# EAGLE design LRF Breakout (EAGLE 8.6.0)
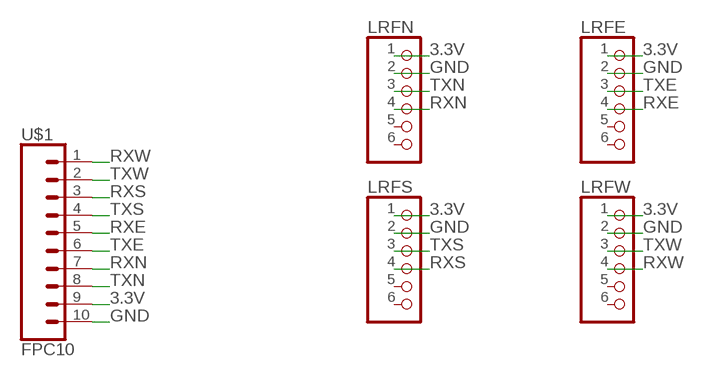
[diagram p0: schematic, sheet 1]

## Parts
LRFE  PINHD-1X6  [1X06]
LRFN  PINHD-1X6  [1X06]
LRFS  PINHD-1X6  [1X06]
LRFW  PINHD-1X6  [1X06]
U$1  FPC10  [FPC10]

## Nets
3.3V: LRFE.1 LRFN.1 LRFS.1 LRFW.1 U$1.9
GND: LRFE.2 LRFN.2 LRFS.2 LRFW.2 U$1.10
RXE: LRFE.4 U$1.5
RXN: LRFN.4 U$1.7
RXS: LRFS.4 U$1.3
RXW: LRFW.4 U$1.1
TXE: LRFE.3 U$1.6
TXN: LRFN.3 U$1.8
TXS: LRFS.3 U$1.4
TXW: LRFW.3 U$1.2
Unconnected: LRFE.5 LRFE.6 LRFN.5 LRFN.6 LRFS.5 LRFS.6 LRFW.5 LRFW.6

## Library data of the parts
LRFE LRFN LRFS LRFW = PinHead+:PINHD-1X6: PIN HEADER
U$1 = FFC:FPC10

## Board
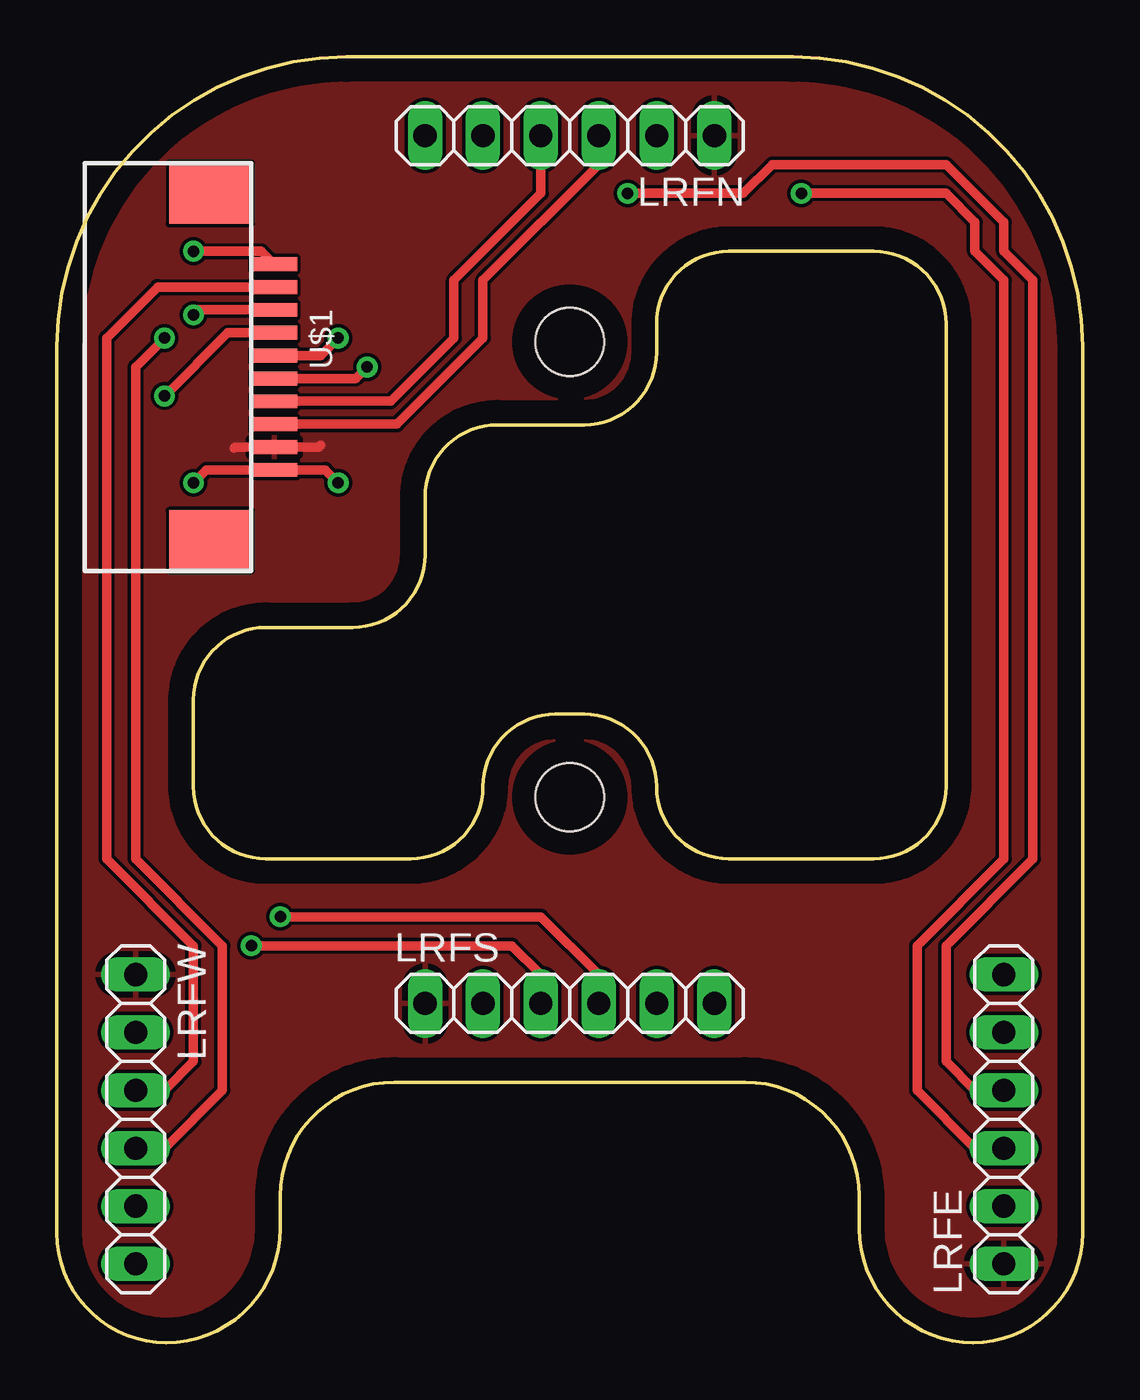
[diagram p1: board, top side]
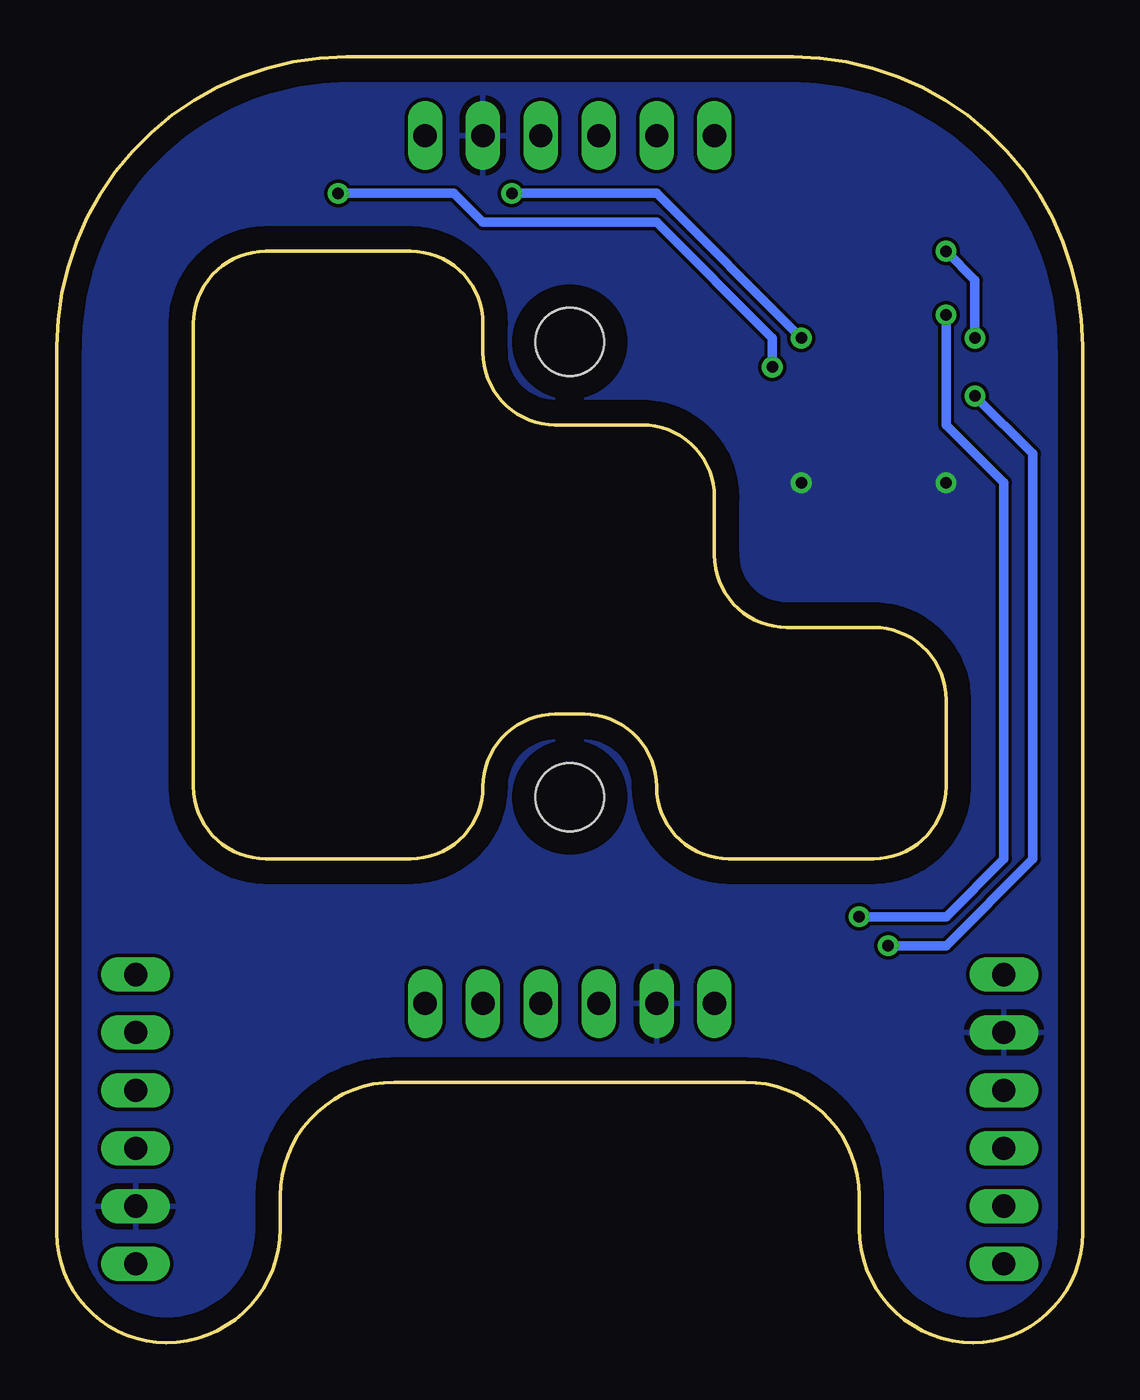
[diagram p2: board, bottom side, seen from below]

Size 45 x 56.43 mm. Coordinates in mm from the lower left corner, seen from the top.
Outline: 45,4.8 45,43.73 arc90 32.3,56.43 12.7,56.43 arc90 0,43.73 0,4.8 arc90 4.8,0 arc90 9.8,5 9.8,6.43 arc-90 14.8,11.43 30.2,11.43 arc-90 35.2,6.43 35.2,5 arc90 40.2,0 arc90 45,4.8
Outline: 9.16,31.39 12.97,31.39 arc90 16.15,34.56 16.15,37.1 arc-90 19.32,40.28 23.14,40.28 arc90 26.31,43.45 26.31,44.73 arc-90 29.48,47.9 35.84,47.9 arc-90 39.01,44.73 39.01,24.41 arc-90 35.84,21.23 29.48,21.23 arc-90 26.31,24.41 arc90 23.14,27.58 21.86,27.58 arc90 18.69,24.41 arc-90 15.52,21.23 9.16,21.23 arc-90 5.99,24.41 5.99,28.21 arc-90 9.16,31.39
Copper layers (1*16): Top 0.035mm / dielectric 1.5mm / Bottom 0.035mm
Design rules "default": minimum track width 6mil, minimum drill 0.35mm, track to track 6mil, track to pad 6mil, pad to pad 6mil, via to via 6mil, smd to smd 6mil, copper to edge 40mil, drill to drill 6mil, minimum pad ring 10mil, minimum via ring 8mil, stop-mask expansion 4mil, vias tented up to drill 0mil, thermal gap 10mil
Holes 3 mm at 22.5,43.93 22.5,23.93

### Footprints (pad centres in the part's own frame; a part is rotated, then mirrored left to right if it is on the bottom)
1X06 = drill 1.016 long: 1 -6.35,0; 2 -3.81,0; 3 -1.27,0; 4 1.27,0; 5 3.81,0; 6 6.35,0
FPC10 = smd 0.61 x 2.007: 1 -4.515,1.003; 2 -3.512,1.003; 3 -2.508,1.003; 4 -1.505,1.003; 5 -0.502,1.003; 6 0.502,1.003; 7 1.505,1.003; 8 2.508,1.003; 9 3.512,1.003; 10 4.515,1.003 | smd 2.667 x 3.607: N/C-1 -7.62,-1.803; N/C-2 7.62,-1.803

### Placement (x,y rotation side)
LRFE  41.55,9.8 90 top
LRFN  22.5,52.98 180 top
LRFS  22.5,14.88 0 top
LRFW  3.45,9.8 270 top
U$1  8.53,42.82 270 top

### Tracks (layer width: path | path; a pad name or v marks a point on that pad's centre or on a via)
3.3V
  Top 0.406: 11.58,39.39 11.49,39.31 U$1.9 7.81,39.31 7.77,39.26
  pour Top: -5.44,58.06 -5.44,-1.63 47.9,-1.63 47.9,58.06
GND  (via drill 0.51)
  Top 0.406: v12.34,37.74 11.78,38.3 U$1.10 6.55,38.3 v5.99,37.74
  pour Bottom: -11.79,60.6 -11.79,-1.63 51.71,-1.63 51.71,60.6
RXE  (via drill 0.51)
  Top 0.406: LRFE.4 40.28,11.07 39.01,12.34 39.01,17.42 42.82,21.23 42.82,46.63 41.55,47.9 41.55,49.17 39.01,51.71 31.39,51.71 30.12,50.44 v25.04,50.44 | v12.34,44.09 11.57,43.32 U$1.5
  Bottom 0.406: v25.04,50.44 18.69,50.44 v12.34,44.09
RXN
  Top 0.406: U$1.7 14.64,41.31 17.42,44.09 17.42,46.63 21.23,50.44 LRFN.4
RXS  (via drill 0.51)
  Top 0.406: LRFS.4 23.77,16.15 21.23,18.69 v9.8,18.69 | v5.99,45.11 6.21,45.33 U$1.3
  Bottom 0.406: v9.8,18.69 5.99,18.69 3.45,21.23 3.45,37.74 5.99,40.28 v5.99,45.11
RXW  (via drill 0.51)
  Top 0.406: LRFW.4 4.72,8.53 7.26,11.07 7.26,17.42 3.45,21.23 3.45,42.82 v4.72,44.09 | v5.99,47.9 8.97,47.9 U$1.1
  Bottom 0.406: v4.72,44.09 4.72,46.63 v5.99,47.9
TXE  (via drill 0.51)
  Top 0.406: LRFE.3 40.28,8.53 37.74,11.07 37.74,17.42 41.55,21.23 41.55,46.63 40.28,47.9 40.28,49.17 39.01,50.44 v32.66,50.44 | v13.61,42.82 13.11,42.32 U$1.6
  Bottom 0.406: v13.61,42.82 13.61,44.09 18.69,49.17 26.31,49.17 27.58,50.44 v32.66,50.44
TXN
  Top 0.406: U$1.8 14.91,40.31 18.69,44.09 18.69,46.63 23.77,51.71 LRFN.3
TXS  (via drill 0.51)
  Top 0.406: LRFS.3 21.23,16.15 19.96,17.42 v8.53,17.42 | v4.72,41.55 7.49,44.33 U$1.4
  Bottom 0.406: v8.53,17.42 5.99,17.42 2.18,21.23 2.18,39.01 v4.72,41.55
TXW
  Top 0.406: LRFW.3 4.72,11.07 5.99,12.34 5.99,17.42 2.18,21.23 2.18,44.09 4.42,46.33 U$1.2